# Altium schematic sheet MCU.SchDoc
size A
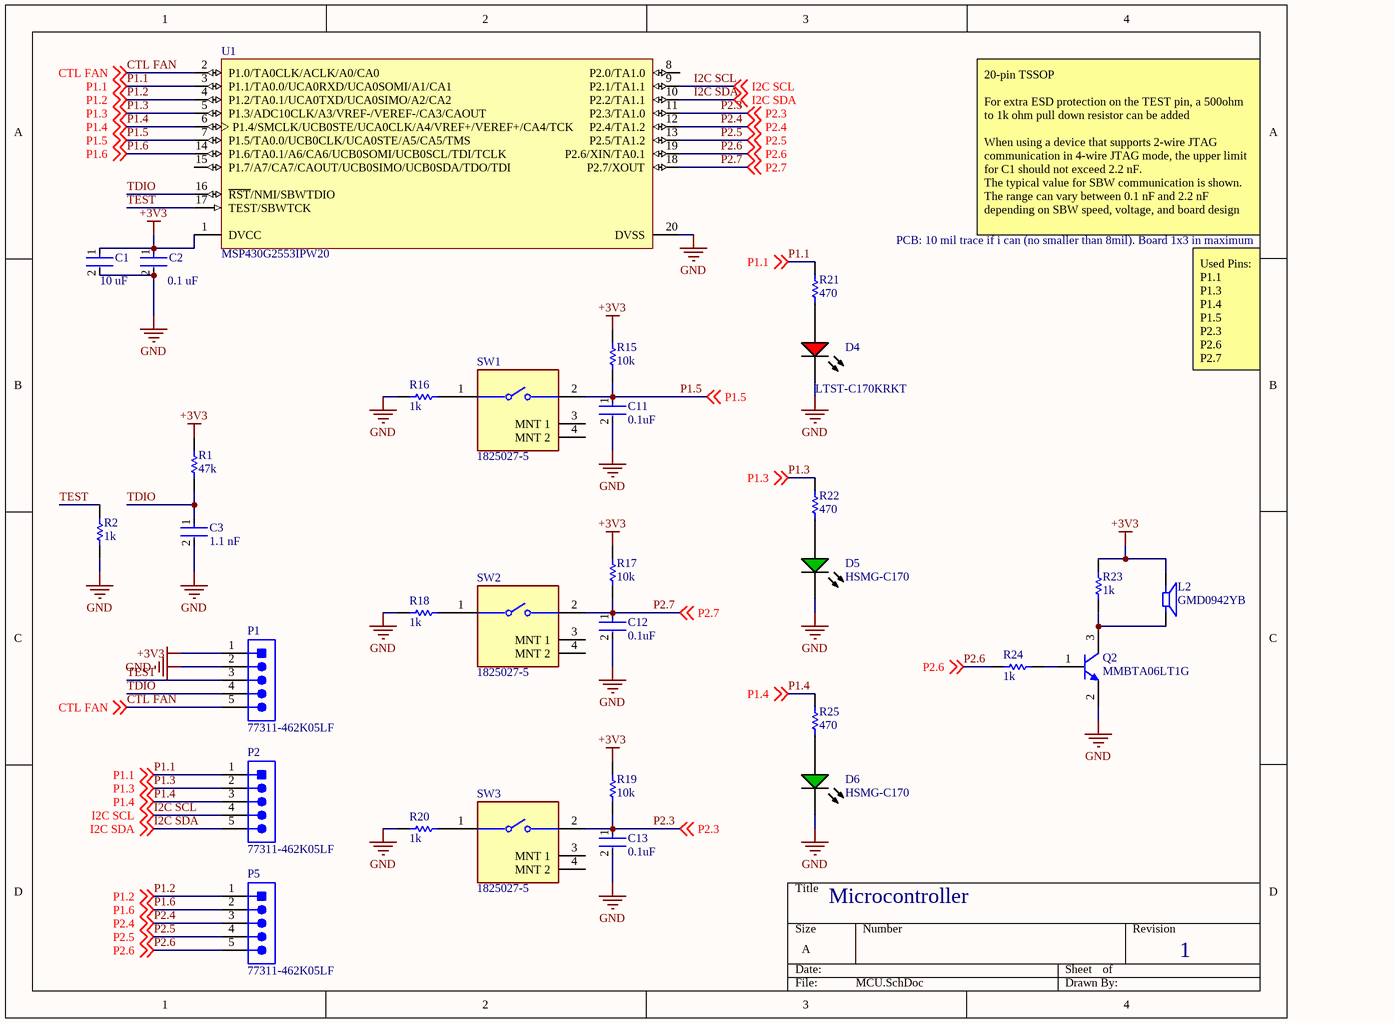
[diagram p0: MCU.SchDoc]

## Parts
C1  10 uF  [FP-C0805C-DG-MFG]
C2  0.1 uF  [FP-C0805C-DG-MFG]
C3  1.1 nF  [FP-C0805C-DG-MFG]
C11  0.1uF  [FP-C0805C-DG-MFG]
C12  0.1uF  [FP-C0805C-DG-MFG]
C13  0.1uF  [FP-C0805C-DG-MFG]
D4  LTST-C170KRKT  [LTST-C170KRKT_V]
D5  HSMG-C170  [AVAG-HSMX-C170_V]
D6  HSMG-C170  [AVAG-HSMX-C170_V]
L2  GMD0942YB  [CPE-171-Footprint-1]
P1  77311-462K05LF  [FCI-77311-5_V]
P2  77311-462K05LF  [FCI-77311-5_V]
P5  77311-462K05LF  [FCI-77311-5_V]
Q2  MMBTA06LT1G  [ONSC-SOT-23-3-318-08_V]
R1  47k  [RESC2013X50X30LL20T20]
R2  1k  [RESC2013X50X30LL20T20]
R15  value 10k  [RESC2013X70X40ML20T20]  (hidden comment: Resistor 1k +/-1% 0805 125 mW)
R16  value 1k  [RESC2013X70X40ML20T20]  (hidden comment: Resistor 1k +/-1% 0805 125 mW)
R17  value 10k  [RESC2013X70X40ML20T20]  (hidden comment: Resistor 1k +/-1% 0805 125 mW)
R18  value 1k  [RESC2013X70X40ML20T20]  (hidden comment: Resistor 1k +/-1% 0805 125 mW)
R19  value 10k  [RESC2013X70X40ML20T20]  (hidden comment: Resistor 1k +/-1% 0805 125 mW)
R20  value 1k  [RESC2013X70X40ML20T20]  (hidden comment: Resistor 1k +/-1% 0805 125 mW)
R21  value 470  [RESC2013X70X40ML20T20]  (hidden comment: Resistor 1k +/-1% 0805 125 mW)
R22  value 470  [RESC2013X70X40ML20T20]  (hidden comment: Resistor 1k +/-1% 0805 125 mW)
R23  value 1k  [RESC2013X70X40ML20T20]  (hidden comment: Resistor 1k +/-1% 0805 125 mW)
R24  value 1k  [RESC2013X70X40ML20T20]  (hidden comment: Resistor 1k +/-1% 0805 125 mW)
R25  value 470  [RESC2013X70X40ML20T20]  (hidden comment: Resistor 1k +/-1% 0805 125 mW)
SW1  1825027-5  [FP-1825027-5-0]
SW2  1825027-5  [FP-1825027-5-0]
SW3  1825027-5  [FP-1825027-5-0]
U1  MSP430G2553IPW20  [PW0020A_L]

## Nets
+3V3: C1.1 C2.1 L2.1 P1.1(DTR) R1.2 R15.1 R17.1 R19.1 R23.1 U1.1(DVCC)
GND: C1.2 C2.2 C3.2 C11.2 C12.2 C13.2 D4.2(K) D5.2(K) D6.2(K) P1.2(RXI) Q2.2(E) R2.1 R16.2 R18.2 R20.2 U1.20(DVSS)
CTL FAN: P1.5(CTS) U1.2(P1.0/TA0CLK/ACLK/A0/CA0) ; off-sheet CTL FAN
I2C SCL: P2.4(VCC) U1.9(P2.1/TA1.1) ; off-sheet I2C SCL
I2C SDA: P2.5(CTS) U1.10(P2.2/TA1.1) ; off-sheet I2C SDA
P1.1: P2.1(DTR) R21.2 U1.3(P1.1/TA0.0/UCA0RXD/UCA0SOMI/A1/CA1) ; off-sheet P1.1
P1.2: P5.1(DTR) U1.4(P1.2/TA0.1/UCA0TXD/UCA0SIMO/A2/CA2) ; off-sheet P1.2
P1.3: P2.2(RXI) R22.2 U1.5(P1.3/ADC10CLK/A3/VREF-/VEREF-/CA3/CAOUT) ; off-sheet P1.3
P1.4: P2.3(TXO) R25.2 U1.6(P1.4/SMCLK/UCB0STE/UCA0CLK/A4/VREF+/VEREF+/CA4/TCK) ; off-sheet P1.4
P1.5: C11.1 R15.2 SW1.2 U1.7(P1.5/TA0.0/UCB0CLK/UCA0STE/A5/CA5/TMS) ; off-sheet P1.5
P1.6: P5.2(RXI) U1.14(P1.6/TA0.1/A6/CA6/UCB0SOMI/UCB0SCL/TDI/TCLK) ; off-sheet P1.6
P2.3: C13.1 R19.2 SW3.2 U1.11(P2.3/TA1.0) ; off-sheet P2.3
P2.4: P5.3(TXO) U1.12(P2.4/TA1.2) ; off-sheet P2.4
P2.5: P5.4(VCC) U1.13(P2.5/TA1.2) ; off-sheet P2.5
P2.6: P5.5(CTS) R24.1 U1.19(P2.6/XIN/TA0.1) ; off-sheet P2.6
P2.7: C12.1 R17.2 SW2.2 U1.18(P2.7/XOUT) ; off-sheet P2.7
TDIO: C3.1 P1.4(VCC) R1.1 U1.16(~{RST}/NMI/SBWTDIO)
TEST: P1.3(TXO) R2.2 U1.17(TEST/SBWTCK)
NetD4_1: D4.1(A) R21.1
NetD5_1: D5.1(A) R22.1
NetD6_1: D6.1(A) R25.1
NetL2_2: L2.2 Q2.3(C) R23.2
NetQ2_1: Q2.1(B) R24.2
NetR16_1: R16.1 SW1.1
NetR18_1: R18.1 SW2.1
NetR20_1: R20.1 SW3.1

Not connected (* = marked no-connect by the designer): SW1 3(MNT_1) 4(MNT_2); SW2 3(MNT_1) 4(MNT_2); SW3 3(MNT_1) 4(MNT_2); U1 8(P2.0/TA1.0) 15(P1.7/A7/CA7/CAOUT/UCB0SIMO/UCB0SDA/TDO/TDI)

## Notes on the sheet
- 20-pin TSSOP
  For extra ESD protection on the TEST pin, a 500ohm to 1k ohm pull down resistor can be added
  When using a device that supports 2-wire JTAG communication in 4-wire JTAG mode, the upper limit for C1 should not exceed 2.2 nF.
  The typical value for SBW communication is shown. The range can vary between 0.1 nF and 2.2 nF depending on SBW speed, voltage, and board design
- PCB: 10 mil trace if i can (no smaller than 8mil). Board 1x3 in maximum
- Used Pins:
  P1.1
  P1.3
  P1.4
  P1.5
  P2.3
  P2.6
  P2.7
- Microcontroller
- 1

## Library data of the parts
C1-C3 C11-C13 = CMP-2007-03243-2: CAP CER 10UF 10V X5R 0805; Manufacturer Part Number: C0805C106K8PACTU; Manufacturer: Kemet; 3DS Part Number: 220-00001; Tolerance: 10%; Temperature Coefficient: 15%; Material: Ceramic; Device Class L2: Capacitors; Device Class L1: Passive Components; ComponentLink2URL: https://content.kemet.com/datasheets/KEM_C1006_X5R_SMD.pdf; Height: 1.4mm; Lead Free: Yes; Digikey Description: CAP CER 10UF 10V X5R 0805; Octopart: https://octopart.com/c0805c106k8pactu-kemet-98697; Capacitance: 10uF; Value: 10uF; Temperature Range Low: -55°C; Temperature: -55°C to +85°C; Automotive: No; Mouser Description: CAP CER 10UF 10V X5R 0805; Ipc Land Pattern Name: CAPC200125X125; Temperature Range High: +85°C; Voltage: 10V; RoHS: TRUE; Device Class L3: Ceramic Capacitors; ComponentLink2Description: Datasheet; Voltage Rating: 10V; Package: C0805C-DG; Temperature Characteristic: X5R; Category: Cap
D4 = CMP-2000-07593-1: LED Red, 75 mW, 54 mcd, -55 to 85 degC, 2-Pin SMD, RoHS, Tape and Reel / LCSC Part # C94868; Manufacturer: Lite-On; Lens Transparency: Clear; Number of Elements: 1; Power Rating: 75mW; Luminous Intensity: 54mcd; Viewing Angle: 130degrees; Forward Current: 30mA; Wavelength: 639nm; Lens Style: Rectangular; Case\/Package: 0805; Test Current: 20mA; Dominant Wavelength: 631nm; Forward Voltage: 2V; Lens Colour: Colorless; Min Operating Temperature: -55degC; RoHSCompliant: True; Length: 3.2mm; Width: 1.25mm; Mount: SurfaceMount; Packaging: TapeandReel; Number of LEDs: 1; Radiation Hardening: No; Datasheet URL: http://optoelectronics.liteon.com/upload/download/DS-22-99-0150/LTST-C170KRKT.pdf; Datasheet Version: Rev. D, 11/2014; Case Code (Metric): 2012; Height: 1.1mm; Number of Pins: 2; Package Description: 2-Pin Surface Mount Device, Body 2 x 1.25 mm; Manufacturer URL: http://www.us.liteon.com/; Lead Free: LeadFree; Illumination Colour: Red; Colour: Red; Case Code (Imperial): 0805; Max Operating Temperature: 85degC; Power Dissipation: 75mW; Mounting Technology: SurfaceMount; Package Reference: C170KRKT; Package Quantity: 1; Depth: 1.6mm
D5 D6 = CMP-2000-05062-1: Chip LED, Green, 2.2 V, -40 to 85 degC, 2-Pin SMD, Pb-Free, Tape and Reel / LCSC Part # C188728; Manufacturer: Avago; No. of Pins: 2; Peak Wavelength: 570nm; SVHC: NoSVHC(16-Jun-2014); Dominant Wavelength: 572nm; Forward Current If: 20mA; Viewing Angle: 170deg; Lens Shape: Rectangular; PIV Max: 5V; External Width: 1.25mm; LED Type: Standard; External Depth: 0.8mm; Opto Mounting Orientation: Top; Luminous Intensity: 15mcd; Luminous Intensity Min: 4mcd; Forward Voltage VF Max: 2.6V; External Length / Height: 2mm; Bulb Size: 1.25mmx1.4mm; Light Area Height: 1mm; Voltage Vf Typ: 2.2V; Operating Temperature Max: 85degC; Datasheet Version: Oct-08; MSL: MSL2A-4weeks; Peak Forward Current: 20mA; Package Description: 2-Pin Surface Mount Device, Body 2 x 1.25 mm, Height 0.8 mm; Datasheet URL: https://datasheet.ciiva.com/29280/180495-da-01-en-chip-led-hsmg-c170-gelb-gruen-29280971.pdf; Storage Temperature Min: -40degC; LED Colour: Green; Wavelength Typ: 570nm; Mounting Type: SMD; Forward Current If Max: 20mA; Dominant Wavelength Typ: 572nm; LED Mounting: SMD; Operating Temperature Range: -30degCto+85degC; Operating Temperature Min: -30degC; Manufacturer URL: http://www.avagotech.com/; Packaging: CutTape; Luminous Intensity Typ: 15mcd; Package Reference: HSMX-C170; Storage Temperature Max: 85degC; Opto Case Style: SMD; Forward Voltage: 2.2V
L2 = CMP-001-0014-1: CPE-171 (actual footpring) / Buzzers Transducer, Externally Driven Piezo 3V 4kHz 75dB @ 3V, 10cm Through Hole PC Pins / GMD0942YB (using this one from JLC so that JLC solders it for us). This buzzer is manufactured by INGHAI electronics. / datasheet: https://datasheet.lcsc.com/szlcsc/2001132233_INGHAi-GMD0942YB-3V2700_C252932.pdf
P1 P2 P5 = CMP-1698-00006-1: Male Header, Pitch 2.54 mm, 1 x 5 Position, Height 16.24 mm, Tail Length 3.05 mm, / -65 to 125 degC, RoHS, Tape and Reel / WON'T BE POPULATED BY MANUFACTURER; Shielding: Shielded; Current Rating: 1 A; Gender: Female; ComponentLink2URL: http://portal.fciconnect.com/Comergent//fci/drawing/77311.pdf; ComponentLink1URL: http://portal.fciconnect.com/; ComponentLink2Description: Datasheet; Max Operating Temperature: 85degC; Package Quantity: 500; PackageDescription: Male Header, Pitch 2.54 mm, 1 x 5 Position, Height 16.24 mm, Tail Length 3.05 mm; ComponentLink1Description: Manufacturer URL; Min Operating Temperature: -25degC; Contact Material: Brass; PackageReference: 77311-5; RoHSCompliant: True; Packaging: Tape and Reel; DatasheetVersion: Rev. CK, 07/2016
Q2 = CMP-1048-00619-1: Driver Transistor, NPN Silicon, 3-Pin SOT-23, Pb-Free, Tape and Reel / LCSC Part # C77760; Manufacturer: On Semiconductor; IC Continuous (A): 0.5; fT Min (MHz): 100; ComponentLink1URL: http://www.onsemi.com/; ComponentLink1Description: Manufacturer URL; ComponentLink2Description: Datasheet; ComponentLink3URL: http://www.onsemi.cn/pub_link/Collateral/318-08.PDF; Packing: Tape and Reel; PackageVersion: Rev. AP, 11/2009; PackageDescription: 3-Pin Small Outline Transistor, Body 2.92 x 1.3 mm, Pitch 0.95 mm; RoHS: TRUE; PartNumber: MMBTA06LT1G; ComponentLink2URL: http://www.onsemi.cn/pub_link/Collateral/MMBTA05LT1-D.PDF; DatasheetVersion: Rev. 8; PackageReference: SOT-23-3-318-08; Polarity: NPN; ComponentLink3Description: Package Specification; Mounting Technology: Surface Mount
R1 R2 = CMP-2001-04896-1: Manufacturer: Vishay Dale; Part Number: CRCW08050000Z0EA
R15-R25 = CMP-009-00010-4: Chip Resistor, 1 KOhm, +/- 1%, 0.125 W, -55 to 155 degC, 0805 (2013 Metric); Power: 125mW; Voltage Rating: 150V; Min Operating Temperature: -55°C; RoHS Compliant: True; Max Operating Temperature: 155°C; Case/Package: 0805; Pins: 2; Tolerance: 1%; Mounting Technology: SM
SW1-SW3 = CMP-2000-05514-2: SWITCH TACTILE SPST-NO 0.05A 24V / LCSC Part # C86476; Manufacturer: TE Connectivity; Contact Current Rating: 50mA; Contact Resistance: 100mΩ; Electromechanical Life: 100000Cycles; Operating Force: 160gf; Throw Configuration: SPST-NO; Lead Free: Yes; Digikey Description: SWITCH TACTILE SPST-NO 0.05A 24V; ComponentLink2Description: Datasheet; Height: 7.31mm; ComponentLink2URL: https://www.te.com/commerce/DocumentDelivery/DDEController?Action=showdoc&DocId=Customer+Drawing%7F1825027%7FG4%7Fpdf%7FEnglish%7FENG_CD_1825027_G4.pdf%7F1825027-5; Mount: Through Hole; Temperature Range High: +85°C; Temperature: -35°C to +85°C; RoHS: TRUE; Device Class L3: Pushbutton Switches; Package: 1825027-5; Temperature Range Low: -35°C; Category: Switch; Automotive: No; Octopart: https://octopart.com/1825027-5-te+connectivity-46510878; Mouser Description: Tactile Switches R/A TACT 160G PB SWITCH; Manufacturer Part Number: 1825027-5; Voltage Rating Dc: 24V; Device Class L2: Switches; Device Class L1: Electromechanical
U1 = CMP-0365-00585-2: 16 MHz Mixed Signal Microcontroller with 16 KB Flash, 512 B SRAM and 24 GPIOs, -40 to 85 degC, 20-pin SOP (PW), Green (RoHS & no Sb/Br) / LCSC Part # C53923; Manufacturer: Texas Instruments; Timers - 16-bit: 2; Temp Sensor: Yes; USCI_B (I2C & SPI): 1; SRAM(B): 512; ADC: 10-bit SAR; Frequency(MHz): 16; SubFamily: Value Line; ADC Channels: 8; GPIO: 24; PackageVersion: 4040064-5/G; PartNumber: MSP430G2553IPW20; DatasheetVersion: SLAS735G; ComponentLink2URL: http://www.ti.com/general/docs/lit/getliterature.tsp?genericPartNumber=MSP430G2553&fileType=pdf; Code_JEDEC: MO-153; PackageDescription: 20-Pin Plastic Small Outline, Body 6.5 x 4.4 mm, 0.65 mm Pitch; Eco-Plan: Green (RoHS & no Sb/Br); ComponentLink3Description: Package Specification; Watchdog: Yes; Flash(KB): 16; ComponentLink2Description: Datasheet; Brown Out Reset: Yes; Comparators: Yes; ComponentLink1URL: http://www.ti.com/; ComponentLink1Description: Manufacturer URL; Cap touch I/O: Yes; USCI_A (UART/LIN/IrDA/SPI): 1; PackageReference: PW0020A; Mounting Technology: Surface Mount; ComponentLink3URL: http://www.ti.com.cn/cn/lit/ml/mpds362/mpds362.pdf